# EAGLE design Adafruit BNO055 (EAGLE 9.6.2)
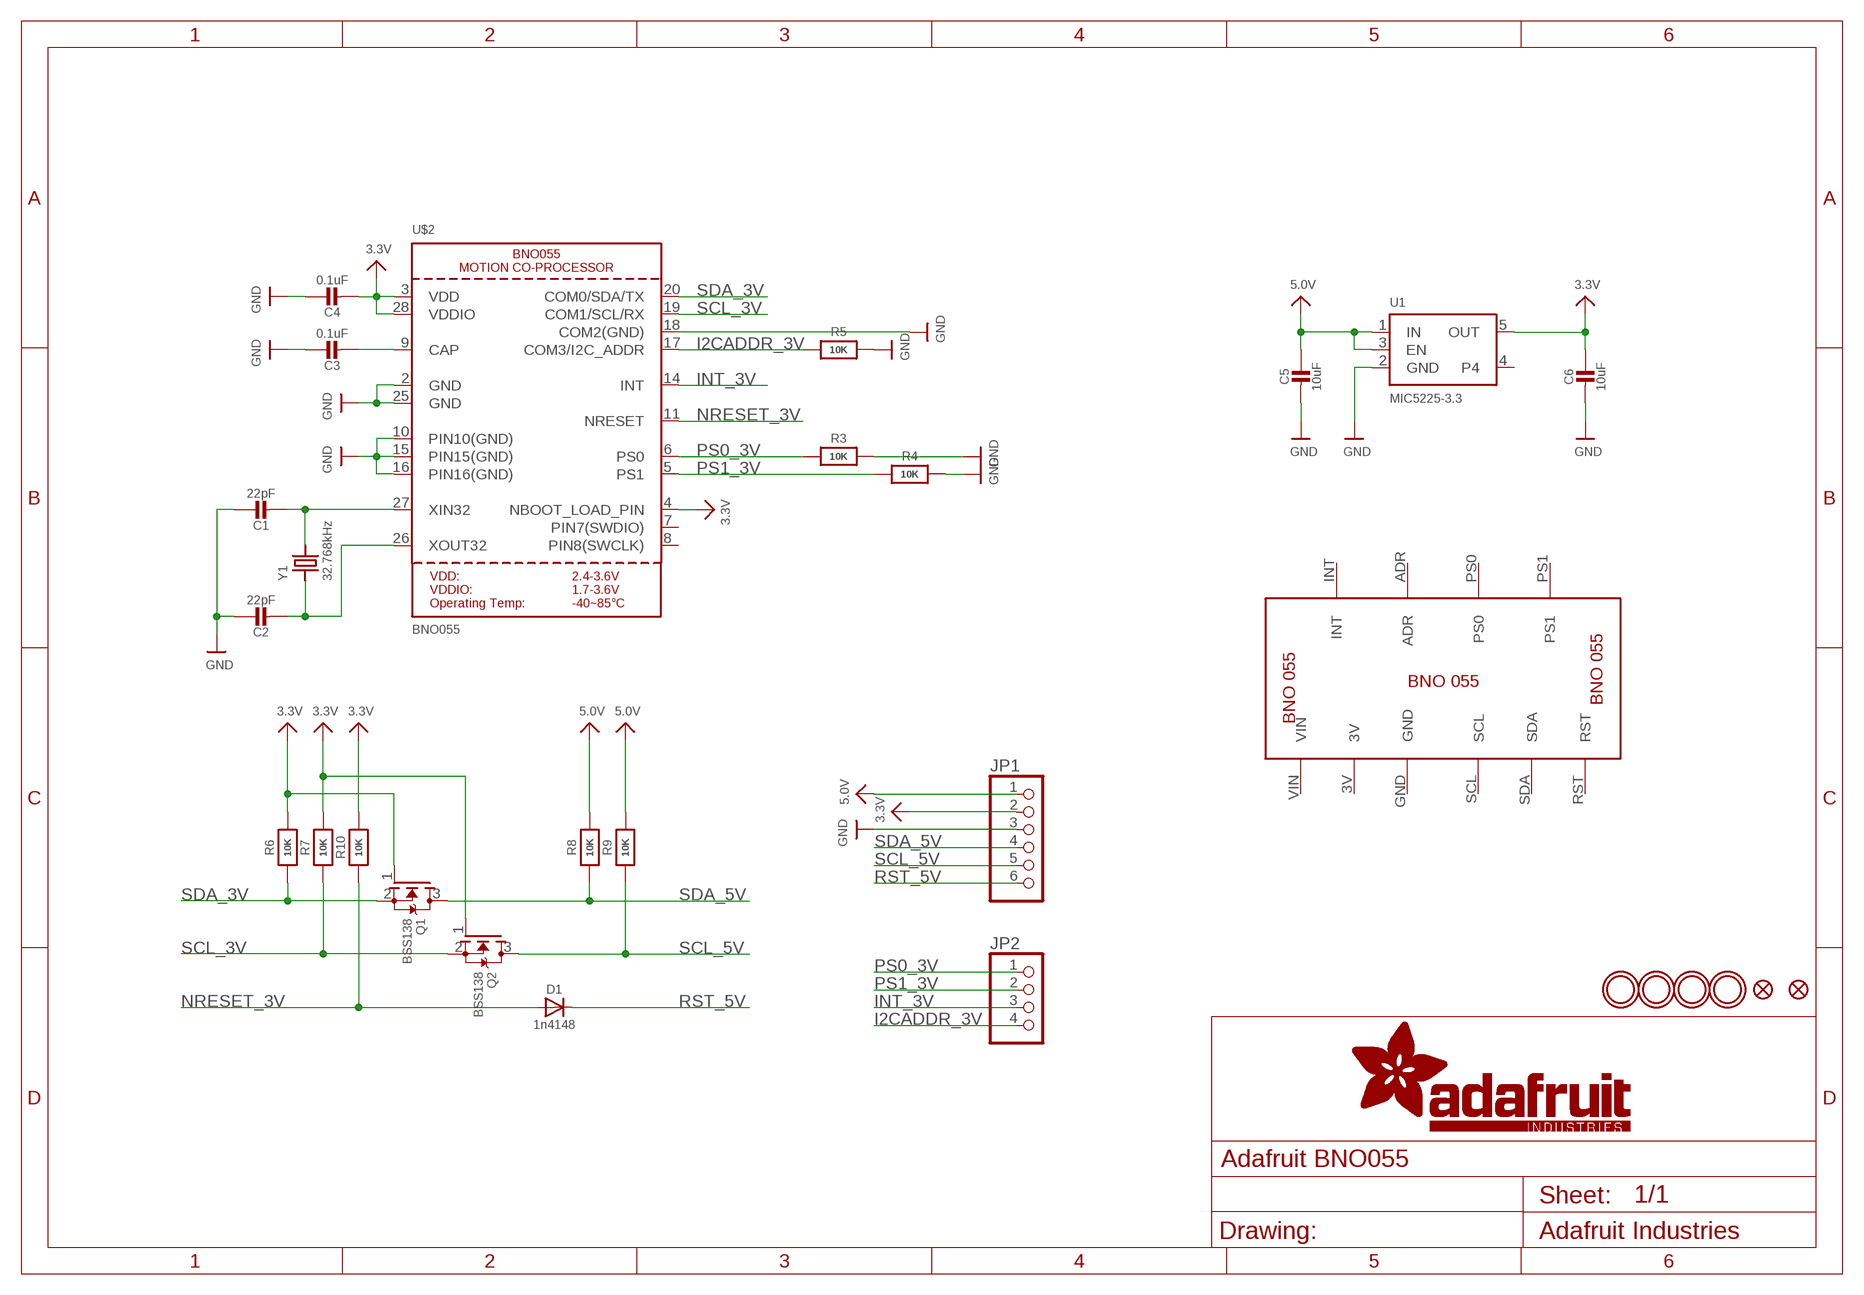
[diagram p0: schematic, sheet 1]

## Parts
C1  22pF  CAP_CERAMIC0805-NOOUTLINE  [0805-NO]
C2  22pF  CAP_CERAMIC0805-NOOUTLINE  [0805-NO]
C3  0.1uF  CAP_CERAMIC0805-NOOUTLINE  [0805-NO]
C4  0.1uF  CAP_CERAMIC0805_10MGAP  [0805_10MGAP]
C5  10uF  CAP_CERAMIC0805-NOOUTLINE  [0805-NO]
C6  10uF  CAP_CERAMIC0805_10MGAP  [0805_10MGAP]
D1  1n4148  DIODESOD-323  [SOD-323]
FID1  FIDUCIAL""  [FIDUCIAL_1MM]
FID2  FIDUCIAL""  [FIDUCIAL_1MM]
JP1  HEADER-1X676MIL  [1X06_ROUND_76]
JP2  HEADER-1X476MIL  [1X04_ROUND_76]
Q1  BSS138  MOSFET-NWIDE  [SOT23-WIDE]
Q2  BSS138  MOSFET-NWIDE  [SOT23-WIDE]
R3  10K  RESISTOR0805_NOOUTLINE  [0805-NO]
R4  10K  RESISTOR0805_NOOUTLINE  [0805-NO]
R5  10K  RESISTOR0805_NOOUTLINE  [0805-NO]
R6  10K  RESISTOR0805_NOOUTLINE  [0805-NO]
R7  10K  RESISTOR0805_NOOUTLINE  [0805-NO]
R8  10K  RESISTOR_0805MP  [_0805MP]
R9  10K  RESISTOR_0805MP  [_0805MP]
R10  10K  RESISTOR0805_NOOUTLINE  [0805-NO]
U1  MIC5225-3.3  VREG_SOT23-5  [SOT23-5]
U$2  BNO055  [BNO055]
U$29  MOUNTINGHOLE2.5_THICK  [MOUNTINGHOLE_2.5_PLATED_THICK]
U$30  MOUNTINGHOLE2.5_THICK  [MOUNTINGHOLE_2.5_PLATED_THICK]
U$31  MOUNTINGHOLE2.5_THICK  [MOUNTINGHOLE_2.5_PLATED_THICK]
U$32  MOUNTINGHOLE2.5_THICK  [MOUNTINGHOLE_2.5_PLATED_THICK]
U$34  BNO055  [BNO055]
Y1  32.768kHz  CRYSTAL8.0X3.8  [CRYSTAL_8X3.8]

## Nets
3.3V: C4.2 C6.1 JP1.2 Q1.1(G) Q2.1(G) R6.2 R7.2 R10.2 U1.5(OUT) U$2.3(VDD) U$2.4(NBOOT_LOAD_PIN) U$2.28(VDDIO)
5.0V: C5.1 JP1.1 R8.2 R9.2 U1.1(IN) U1.3(EN)
GND: C1.1 C2.1 C3.1 C4.1 C5.2 C6.2 JP1.3 R3.2 R4.2 R5.2 U1.2(GND) U$2.2(GND) U$2.10(PIN10(GND)) U$2.15(PIN15(GND)) U$2.16(PIN16(GND)) U$2.18(COM2(GND)) U$2.25(GND)
I2CADDR_3V: JP2.4 R5.1 U$2.17(COM3/I2C_ADDR)
INT_3V: JP2.3 U$2.14(INT)
N$1: C1.2 U$2.27(XIN32) Y1.P$4
N$2: C2.2 U$2.26(XOUT32) Y1.P$1
N$3: C3.2 U$2.9(CAP)
NRESET_3V: D1.A R10.1 U$2.11(NRESET)
PS0_3V: JP2.1 R3.1 U$2.6(PS0)
PS1_3V: JP2.2 R4.1 U$2.5(PS1)
RST_5V: D1.C JP1.6
SCL_3V: Q2.2(S) R7.1 U$2.19(COM1/SCL/RX)
SCL_5V: JP1.5 Q2.3(D) R9.1
SDA_3V: Q1.2(S) R6.1 U$2.20(COM0/SDA/TX)
SDA_5V: JP1.4 Q1.3(D) R8.1
Unconnected: U1.4 U$2.7(PIN7(SWDIO)) U$2.8(PIN8(SWCLK)) U$34.3V U$34.ADR U$34.GND U$34.INT U$34.PS0 U$34.PS1 U$34.RST U$34.SCL U$34.SDA U$34.VIN

## Library data of the parts
C1-C6 = microbuilder:CAP_CERAMIC: Ceramic Capacitors For new designs, use the packages preceded by an '_' character since they are more reliable: The following footprints should be used on most boards: _0402 - Standard footprint for regular board layouts _0603 - Standard footprint for regular board layouts _0805 - Standard footprint for regular board layouts _1206 - Standard footprint for regular board layouts For extremely tight-pitch boards where space is at a premium, the following 'micro-pitch' footprints can be used (smaller pads, no silkscreen outline, etc.): _0402MP - Micro-pitch footprint for very dense/compact boards _0603MP - Micro-pitch footprint for very dense/compact boards _0805MP - Micro-pitch footprint for very dense/compact boards _1206MP - Micro-pitch footprint for very dense/compact boards
D1 = microbuilder:DIODE: Diode SMA Model Volts Amps Type Vf Ir Digikey # Notes SSA34-E3 40V 3A Schottky 480mV @ 3A 200uA @ 40V SSA34-E3/61TGITR-ND CDBA120-G 20V 1A Schottky 500mV @ 1A 500uA @ 20V 641-1014-6-ND REEL MBRA210 10V 2A Schottky 350mV @ 2A 700uA @ 10V MBRA210LT3 SOD-123 Model Volts Amps Type Vf Ir Order # Notes BAT54T1G 30V 200mA Schottky 800mV @ 200mA 2uA @ 25V BAT54T1GOSTR-ND B0530W 30V 500mA Schottky 430mV @ 500mA 130uA @ 30V B0530W-FDICT-ND REEL MBR120 20V 1A Schottky 340mV @ 1A MBR120VLSFT1GOSCT-ND SOD-323 Model Volts Amps Type Vf Ir Order # Notes PMEG2005EJ 20V 500mA Schottky 355mV @ 500mA 568-4110-1-ND ZLLS410 10V 570mA Schottky 380mV @ 570mA ZLLS410CT-ND 1N4148WS 75V 150mA Silicon/Simple 1V 1N4148WSFSCT-ND REEL SOD-523 Model Volts Amps Type Vf Ir Order # Notes BAT54XV2 30V 200mA Schottky 0.8V @ 100mA BAT54XV2CT-ND TB751S 30V 30mA Schottky RB751S-40TE61CT-ND SOT23-R/W (R = Solder Paste/Reflow Ovens, W = Hand-Soldering) Model Volts Amps Type Vf Ir Order # Notes BAT54FILM 40V 300mA Schottky 497-7162-1-ND POWERDI-5 Model Volts Amps Type Vf Ir Order # Notes PDS560 60V 5A Schottky 670mV @ 5A 150uA @ 60V PDS560DICT-ND
FID1 FID2 = microbuilder:FIDUCIAL: Fiducial Alignment Points Various fiducial points for machine vision alignment.; BOM: EXCLUDE
JP1 = microbuilder:HEADER-1X6: PIN HEADER
JP2 = microbuilder:HEADER-1X4: PIN HEADER
Q1 Q2 = microbuilder:MOSFET-N: N-Channel Mosfet LEGEND VDS: Voltage Drain-Source ID: Drain Current RDS(ON): Drain-Source On-State Resistance VGS(TH): Gate-Source Threshold Voltage CISS: Drain-Source Input Capacitance SOT-23 Name VDS ID RDS(ON) VGS(TH) CISS Order Number 2N7002E 60V 260mA 2.5 Ohm 2.5V @ 250uA 26.7pF @ 25V 2N7002ET1GOSTR-ND BSH103 30V 850mA 400 mOhm 400mV @ 1mA 83pF @ 24V BSH103,235-ND BSS138 60V 320mA 1.6 Ohm 1.5V @ 250uA 50pF @ 10V Mouser: 771-BSS138PW115 DMN2075U-7 20V 4.2A 38 mOhm 1V @ 250 uA 594.3pF @ 10V DMN2075U-7DICT-ND * BSS138 good choice for I2C level-shifting POWERPAK 1212-8 Name VDS ID RDS(ON) VGS(TH) CISS Order Number Si7308DN 60V 6A 58 mOhm 3V @ 250uA 665pF @ 15V SI7308DN-T1-E3CT-ND
R3-R10 = microbuilder:RESISTOR: Resistors For new designs, use the packages preceded by an '_' character since they are more reliable: The following footprints should be used on most boards: _0402 - Standard footprint for regular board layouts _0603 - Standard footprint for regular board layouts _0805 - Standard footprint for regular board layouts _1206 - Standard footprint for regular board layouts For extremely tight-pitch boards where space is at a premium, the following 'micro-pitch' footprints can be used (smaller pads, no silkscreen outline, etc.): _0402MP - Micro-pitch footprint for very dense/compact boards _0603MP - Micro-pitch footprint for very dense/compact boards _0805MP - Micro-pitch footprint for very dense/compact boards _1206MP - Micro-pitch footprint for very dense/compact boards
U1 = microbuilder:VREG_SOT23-5: SOT23-5 Fixed Voltage Regulators Part Current Out V Out V In V Dropout θJA (°C/W) TJ (°C) Digikey Part No. ADP121 150mA 3.3V 3.4-5.5V 0.09V @ 150mA -- -- ADP121-AUJZ33R7CT-ND ADP121 150mA 3.0V 3.1-5.5V 0.09V @ 150mA -- -- ADP121-AUJZ30R7CT-ND ADP122 300mA 3.3V 3.4-5.5V 0.085V @ 300mA -- -- ADP122AUJZ-3.3-R7CT-ND ADP1712 300mA 3.3V 3.5-5.5V 0.17V @ 300mA -- -- ADP1712AUJZ-3.3-R7TR-ND AP7311 (Low Cost) 150mA 3.3V 3.5-6V 0.15V @ 150mA -- -- AP7311-33WG-7DICT-ND LD39015M18R 150mA 1.8V 1.9V-5.5V 0.08V @ 100mA -- -- 497-6977-1-ND LP2985A-33DBVR 150mA 3.3V 3.3-16V 0.28V @ 150mA 206 150 296-18479-1-ND MCP1824T-3302E/OT 300mA 3.3V 3.5V-6V 0.2V @ 300mA -- -- MCP1824T-3302E/OTCT-ND MIC5205-2.5YM5 TR 150mA 2.5V 2.7-16V 0.165V @ 150mA -- -- 576-1257-2-ND MIC5205-3.0YM5 TR 150mA 3.0V 3.2V-16V 0.165V @ 150mA -- -- 576-1258-2-ND MIC5205-3.3YM5 TR 150mA 3.3V 3.5V-16V 0.165V @ 150mA -- -- 576-1259-2-ND TPS780330220 150mA 3.3V+2.2V 3.6-5.5V 250mV Max -- -- 296-23332-1-ND TDA3663/N1,135 100mA 3.3V 3.5-45V 0.18V @ 50mA -- -- 568-5343-1-ND Max operating temp can be calculated using θJA, TJ (max junction temperature), and power in watts. Set the "Maximum Ambient Temperature" until it reaches TJ ("Max Junction Temperature"), which is the absolute limit for safe use of the regulator: Heat Sink Temperature Calculator <http://www.daycounter.com/Calculators/Heat-Sink-Temperature-Calculator.phtml> For example, With 12V source into a 3.3V LP2985 and a 30mA load, we are dissipating (12V-3.3V) * 0.03A = 0.261W. With a θJA of 206 °C/W, a TJ of 150°C, and 261mW we can safely use the chip without a heat sink up to 75°C (=147.1°C Junction Temperature).
U$2 = microbuilder:BNO055: BNO055 - Motion Co-Processor
U$29-U$32 = microbuilder:MOUNTINGHOLE: Mounting Hole For #2 screws (0.086"/2.18mm width, 0.094"/2.4mm hole) use 2.5mm; BOM: EXCLUDE
U$34 = BNO055_2.0:BNO055
Y1 = microbuilder:CRYSTAL: Crystals HC49UP - Surface Mount Crystal 4.0MHz 18pF +/-30ppm Surface Mount Crystal [Digikey: 535-9857-1-ND] 12.0 MHz Surface Mount Crystal [Digikey: 535-9869-6-ND] 25.0 MHz Surface Mount Crystal [Digikey: 535-9078-1-ND] 2.5 x 2.0mm - MEMs SMT Crystal 16.0 MHz 10pF 20ppm 2.5 x 2.0mm Crystal [Digikey -40-85°C: 535-10923-1-ND] 3.2 x 2.5mm - MEMs SMT Crystal 12.0 MHz 8pF 15ppm 3.2 x 2.5mm Crystal [Digikey: -10-70°C: 644-1047-1-ND -40-125°C: 644-1128-1-ND] 40~85°C cheaper: 644-1173-6-ND 16.0 MHz 8pF 15ppm 3.2 x 2.5mm Crystal [Digikey: -10-70°C: 644-1049-1-ND -40-125°C: 644-1129-2-ND]-40~85°C cheaper: 644-1175-6-ND 16.0 MHz 10pF 10ppm 3.2 x 2.5mm Crystal [Digikey: 644-1100-1-ND] 27.12 MHz 18pF 30ppm 3.2 x 2.5mm Crystal [Digikey: 887-1424-1-ND] 27.12MHz 10pF 10ppm 3.2 x 2.5mm Crystal [Digikey: 887-1329-1-ND] 4.9 x 1.8mm - MEMs SMT Crystal 32.768 KHz 12.5pF 20ppm 4.9 x 1.8mm Crystal [Digikey: SE2415CT-ND] 8.0 x 3.8mm - Surface Mount Crystal 32.768kHz 12.5pF 20ppm -40°C-85°C [Digikey: 535-9166-2-ND] Cylinder 32.768KHz Cylinder Crystal (2x6mm body) [Ex. Digikey: 300-8341-2-ND]

## Board
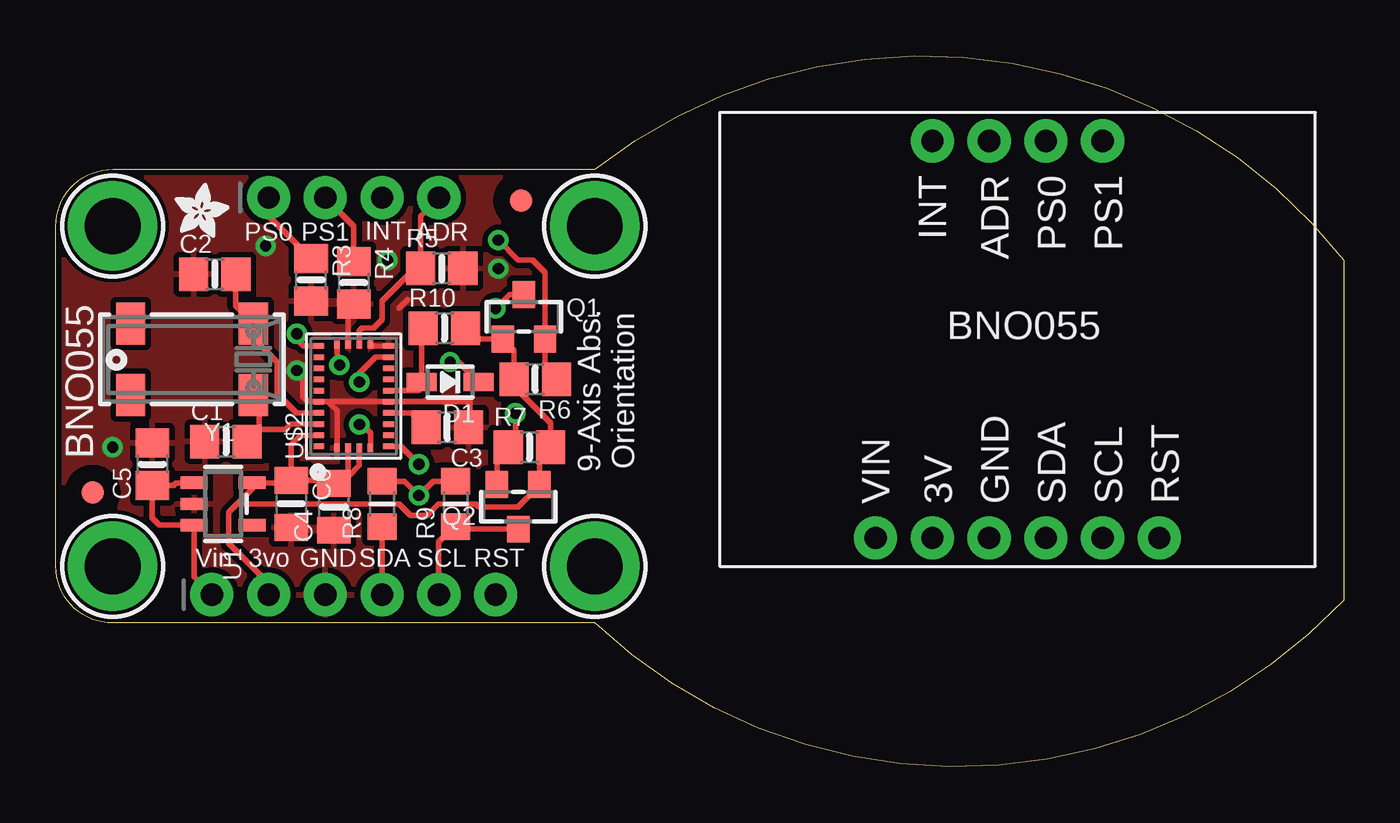
[diagram p1: board, top side]
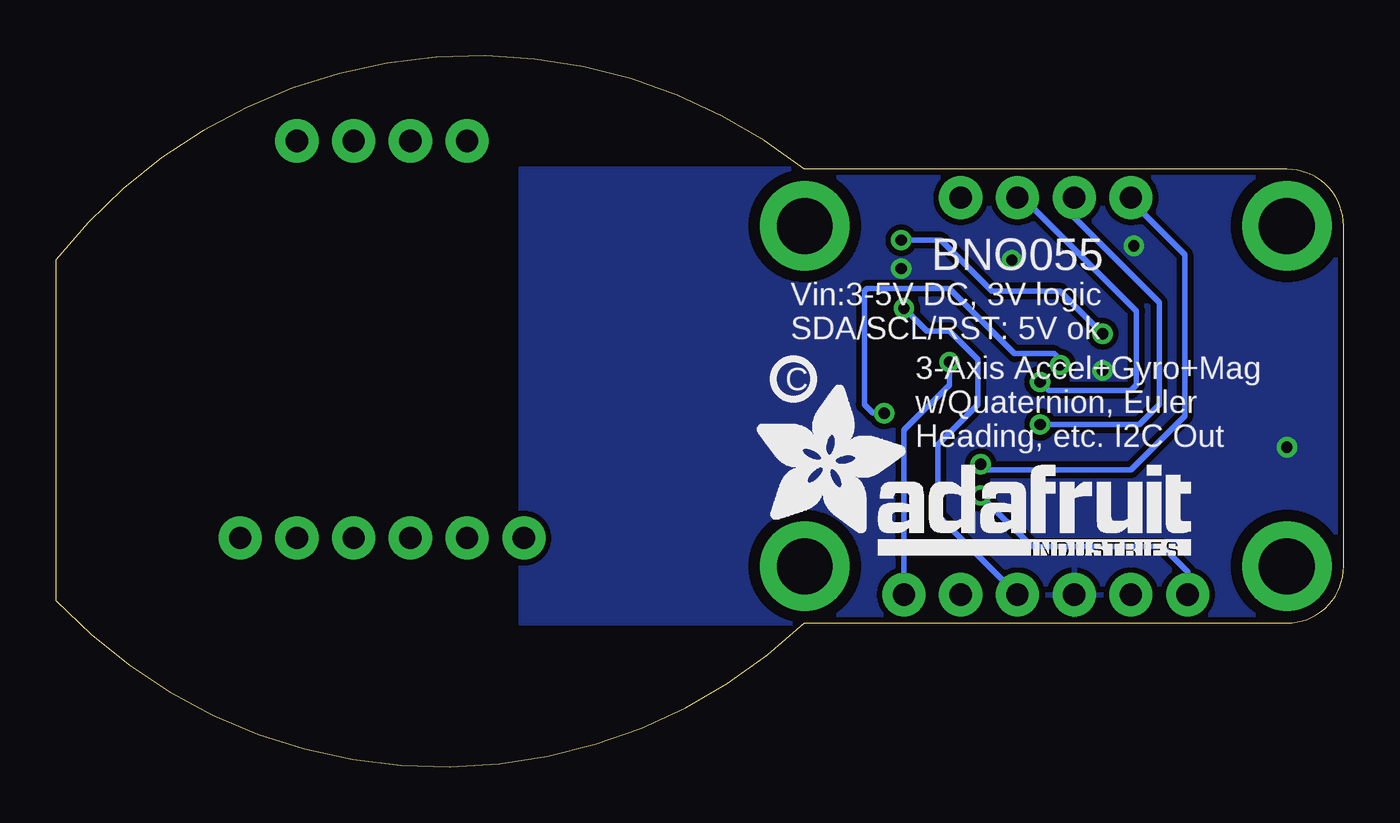
[diagram p2: board, bottom side, seen from below]

Size 57.66 x 31.85 mm. Coordinates in mm from the lower left corner, seen from the top.
Outline: 2.54,26.76 24.13,26.76 arc-90 57.66,22.7 57.66,7.46 arc-90 24.13,6.44 2.54,6.44 arc-90 0,8.98 0,24.22 arc-90 2.54,26.76
Copper layers (1*16): Top 0.035mm / dielectric 1.5mm / Bottom 0.035mm
Design rules "adafruit *": minimum track width 8mil, minimum drill 15.5mil, track to track 8mil, track to pad 8mil, pad to pad 8mil, via to via 8mil, smd to smd 8mil, copper to edge 10mil, drill to drill 8mil, minimum pad ring 10mil, minimum via ring 8mil, stop-mask expansion 2mil, vias tented up to drill 20mil, thermal gap 10mil

### Footprints (pad centres in the part's own frame; a part is rotated, then mirrored left to right if it is on the bottom)
0805-NO = smd 1.3 x 1.5: 1 -0.95,0; 2 0.95,0
0805_10MGAP = smd 1.2 x 1.5: 1 -1.05,0; 2 1.05,0
SOD-323 = smd 1.35 x 0.8: A 1.27,0; C -1.27,0
FIDUCIAL_1MM = smd 1 x 1: 1 0,0
1X06_ROUND_76 = drill 1 pad 1.93: 1 -6.35,0; 2 -3.81,0; 3 -1.27,0; 4 1.27,0; 5 3.81,0; 6 6.35,0
1X04_ROUND_76 = drill 1 pad 1.93: 1 -3.81,0; 2 -1.27,0; 3 1.27,0; 4 3.81,0
SOT23-WIDE = smd 1 x 1.2: 1 -0.95,-1; 2 0.95,-1; 3 0,1
_0805MP = smd 1.2 x 1.3: 1 -1.016,0; 2 1.016,0
SOT23-5 = smd 0.55 x 1.2: 1 -0.95,-1.3; 2 0,-1.3; 3 0.95,-1.3; 4 0.95,1.3; 5 -0.95,1.3
BNO055 = smd 0.25 x 0.475: 1 -2.25,1.562; 6 -2.25,-1.562; 7 -1.75,-1.562; 8 -1.25,-1.562; 9 -0.75,-1.562; 10 -0.25,-1.562; 11 0.25,-1.562; 12 0.75,-1.562; 13 1.25,-1.562; 14 1.75,-1.562; 15 2.25,-1.562; 20 2.25,1.562; 21 1.75,1.562; 22 1.25,1.562; 23 0.75,1.562; 24 0.25,1.562; 25 -0.25,1.562; 26 -0.75,1.562; 27 -1.25,1.562; 28 -1.75,1.562 | smd 0.375 x 0.25: 2 -2.312,0.75; 3 -2.312,0.25; 4 -2.312,-0.25; 5 -2.312,-0.75; 16 2.312,-0.75; 17 2.312,-0.25; 18 2.312,0.25; 19 2.312,0.75
MOUNTINGHOLE_2.5_PLATED_THICK = drill 2.5 pad 4: P$1 0,0
BNO055' = drill 1 pad 1.93: 3V 9.525,1.27; ADR 12.065,19.05; GND 12.065,1.27; INT 9.525,19.05; PS0 14.605,19.05; PS1 17.145,19.05; RST 19.685,1.27; SCL 17.145,1.27; SDA 14.605,1.27; VIN 6.985,1.27
CRYSTAL_8X3.8 = smd 1.3 x 1.9: P$1 -2.75,-1.6; P$2 2.75,-1.6; P$3 2.75,1.6; P$4 -2.75,1.6

### Placement (x,y rotation side)
C1  7.62,14.57 0 top
C2  7.11,22.06 0 top
C3  17.53,15.21 180 top
C4  12.45,11.65 90 top
C5  4.32,13.56 90 top
C6  10.54,11.78 270 top
D1  17.65,17.24 180 top
FID1  20.83,25.37 0 top
FID2  1.65,12.29 0 top
JP1  13.34,7.71 0 top
JP2  13.34,25.49 0 top
Q1  20.95,20.16 0 top
Q2  20.7,11.65 180 top
R3  11.43,21.81 270 top
R4  13.34,21.68 270 top
R5  17.27,22.32 0 top
R6  21.46,17.37 180 top
R7  21.21,14.32 0 top
R8  14.61,11.78 90 top
R9  17.91,11.78 90 top
R10  17.4,19.65 0 top
U1  7.49,11.78 270 top
U$2  13.34,16.6 90 top
U$3  [PCBFEAT-REV-040]  24.64,17.37 0 bottom
U$28  [ADAFRUIT_TEXT_20MM]  26.42,9.49 0 bottom
U$29  2.54,24.22 0 top
U$30  2.54,8.98 0 top
U$31  24.13,24.22 0 top
U$32  24.13,8.98 0 top
U$33  [ADAFRUIT_2.5MM]  5.33,23.72 0 top
U$34  BNO055  [BNO055']  29.72,8.98 0 top
Y1  6.1,18.25 180 top

### Tracks (layer width: path | path; a pad name or v marks a point on that pad's centre or on a via)
3.3V
  Top 0.254: U$2.3 13.09,12.99 | U$2.4 13.59,13.49 13.09,12.99 | U$2.28 10.95,14.85 10.54,14.44 C6.1 | 22.03,14.19 R7.2 | JP1.2 9.53,8.22 7.75,10 7.75,11.4 8.13,11.78 | 8.13,11.78 8.79,12.44 U1.5 10.44,12.73 C6.1 | 8.13,11.78 15.37,11.78 15.88,11.27 16.64,11.27 17.14,11.78 18.8,11.78 18.92,11.65 20.7,11.65 21.65,12.6 Q2.1 21.65,13.81 R7.2 | R10.2 18.84,19.16 Q1.1 20.51,18.65 R6.2 20.51,17.05 22.16,15.4 R7.2 | C6.1 12.32,12.83 C4.2 12.8,12.7 13.09,12.99
5.0V  (via drill 0.5)
  Top 0.254: JP1.1 6.19,8.51 U1.3 4.63,10.83 4.32,11.14 C5.1 5.27,12.61 5.39,12.73 U1.1 | R8.2 15.62,12.79 v16.26,12.16 16.89,12.79 R9.2
  Bottom 0.254: v16.26,12.16 13.97,9.87 8.13,9.87 6.99,8.73 JP1.1
GND  (via drill 0.5)
  Top 0.254: U$2.2 12.59,15.96 12.26,16.29 | 12.26,16.29 12.19,16.35 U$2.25 11.3,16.35 11.05,16.6 11.05,17.62 | U$2.18 13.09,20.48 R4.2 | U$2.16 14.15,18.85 U$2.15 | C3.1 18.54,15.27 18.54,16.35 U$2.10 12.32,16.35 12.26,16.29 | 15.37,20.54 15.75,20.92 | 17.91,22.32 R5.2
  Bottom 0.254: 10.92,18 10.79,18.13
  other vias: 2.54,14.32 9.4,23.33 19.81,22.32 10.79,17.75 14.86,22.7
  pour Bottom (isolate 0.254): 0,26.76 36.83,26.76 36.83,6.44 0,6.44
  pour Top (isolate 0.254): 0,26.76 27.43,26.76 27.43,6.44 0,6.44
I2CADDR_3V
  Top 0.254: U$2.17 13.59,19.52 13.72,19.65 14.22,19.65 14.61,20.03 14.61,20.86 16.07,22.32 R5.1 16.32,24.67 JP2.4
INT_3V  (via drill 0.5)
  Top 0.254: U$2.14 14.32,18.35 13.59,17.62 v13.59,17.24
  Bottom 0.254: v13.59,17.24 13.21,16.86 9.53,16.86 9.27,17.11 9.27,20.41 14.35,25.49 JP2.3
N$1
  Top 0.254: U$2.27 10.53,15.35 10.28,15.1 9.1,15.1 | 9.1,15.1 C1.2 | Y1.P$4 9.1,16.4 9.1,15.1
N$2
  Top 0.254: U$2.26 10.78,15.85 9.91,16.73 9.91,18.13 8.85,19.19 Y1.P$1 8.06,20.64 C2.2
N$3
  Top 0.254: U$2.9 15.93,15.85 C3.2
NRESET_3V
  Top 0.254: U$2.11 16.25,16.85 16.38,16.98 D1.A 16.38,19.72 R10.1
PS0_3V  (via drill 0.5)
  Top 0.254: JP2.1 9.53,24.67 R3.1 | U$2.6 15.46,14.35 v16.26,13.56
  Bottom 0.254: JP2.1 9.53,25.37 7.11,22.95 7.11,15.71 9.53,13.3 16,13.3 v16.26,13.56
PS1_3V  (via drill 0.5)
  Top 0.254: JP2.2 13.34,24.22 R4.1 | U$2.5 14.09,14.96 13.72,15.33 v13.59,15.33
  Bottom 0.254: v13.59,15.33 9.14,15.33 8.26,16.22 8.26,20.79 12.06,24.6 JP2.2
RST_5V  (via drill 0.5)
  Top 0.254: D1.C 18.03,18.13 v17.65,18.13
  Bottom 0.254: JP1.6 19.68,15.08 17.65,17.11 v17.65,18.13
SCL_3V  (via drill 0.5)
  Top 0.254: U$2.19 12.59,18.12 v12.7,18 | v20.57,15.84 20.57,14.38 20.51,14.32 R7.1 19.75,13.81 Q2.2
  Bottom 0.254: v12.7,18 12.7,18.25 12.95,18.51 14.73,18.51 17.65,21.43 21.34,21.43 21.46,21.3 21.46,16.22 21.08,15.84 v20.57,15.84
SCL_5V
  Top 0.254: JP1.5 17.14,10.07 17.84,10.76 R9.1 18.02,10.65 Q2.3
SDA_3V  (via drill 0.5)
  Top 0.254: U$2.20 11.09,18.85 10.79,19.14 v10.79,19.4 | R6.1 21.91,17.87 Q1.2 21.91,22.13 21.34,22.7 20.7,22.7 v19.81,23.59
  Bottom 0.254: v10.79,19.4 12.7,21.3 15.75,21.3 18.03,23.59 v19.81,23.59
SDA_5V  (via drill 0.5)
  Top 0.254: R8.1 JP1.4 | v19.68,20.54 20.3,21.16 Q1.3
  Bottom 0.254: JP1.4 18.16,11.27 18.16,14.44 16.38,16.22 16.38,18.25 17.65,19.52 18.67,19.52 v19.68,20.54

### Text on the board
tPlace: PS0 | PS1 | INT | ADR | BNO055 | 9-Axis Abs. / Orientation | Vin | 3vo | GND | SDA | SCL | RST
bPlace: BNO055 | Vin:3-5V DC, 3V logic / SDA/SCL/RST: 5V ok | 3-Axis Accel+Gyro+Mag / w/Quaternion, Euler / Heading, etc. I2C Out